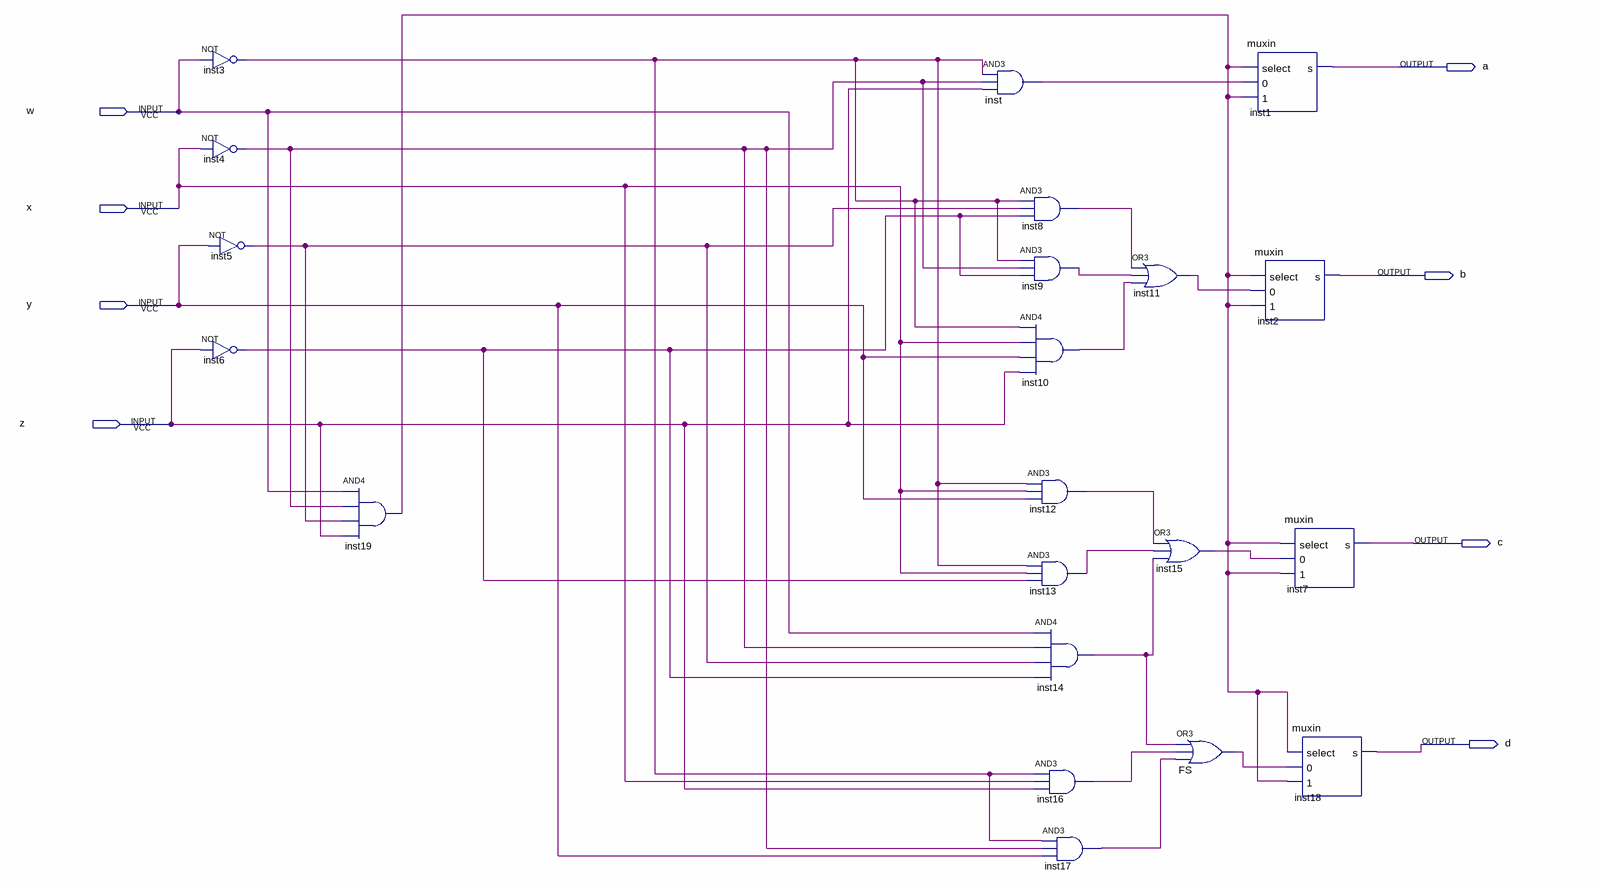
[diagram p0: schematic sheet]
// Quartus schematic outputlogic.bdf as structural Verilog: 21 symbols, 8 pins
module outputlogic (
  input  w,
  input  x,
  input  y,
  input  z,
  output a,
  output b,
  output c,
  output d
);

  wire FS_out, inst3_out, inst4_out, inst5_out, inst6_out, inst8_out, inst9_out, inst10_out, inst11_out,
       inst12_out, inst13_out, inst14_out, inst15_out, inst16_out, inst17_out, inst19_out, inst_out;

  not inst3 (inst3_out, w);
  not inst4 (inst4_out, x);
  not inst5 (inst5_out, y);
  not inst6 (inst6_out, z);
  and inst19 (inst19_out, w, inst4_out, inst5_out, z);
  and inst (inst_out, inst3_out, inst4_out, z);
  and inst8 (inst8_out, inst3_out, inst5_out, inst6_out);
  and inst9 (inst9_out, inst3_out, inst4_out, inst6_out);
  and inst10 (inst10_out, inst3_out, x, y, z);
  and inst12 (inst12_out, inst3_out, x, y);
  and inst13 (inst13_out, inst3_out, x, inst6_out);
  and inst14 (inst14_out, w, inst4_out, inst5_out, inst6_out);
  and inst16 (inst16_out, inst3_out, x, z);
  and inst17 (inst17_out, inst3_out, inst4_out, y);
  or inst11 (inst11_out, inst8_out, inst9_out, inst10_out);
  or inst15 (inst15_out, inst12_out, inst13_out, inst14_out);
  or FS (FS_out, inst14_out, inst16_out, inst17_out);
  muxin inst1 (.select(inst19_out), .\0 (inst_out), .\1 (inst19_out), .s(a));
  muxin inst2 (.select(inst19_out), .\0 (inst11_out), .\1 (inst19_out), .s(b));
  muxin inst7 (.select(inst19_out), .\0 (inst15_out), .\1 (inst19_out), .s(c));
  muxin inst18 (.select(inst19_out), .\0 (FS_out), .\1 (inst19_out), .s(d));
endmodule
